# Altium schematic sheet UltraSoonSensor.SchDoc
size A4; SheetNumber: 6
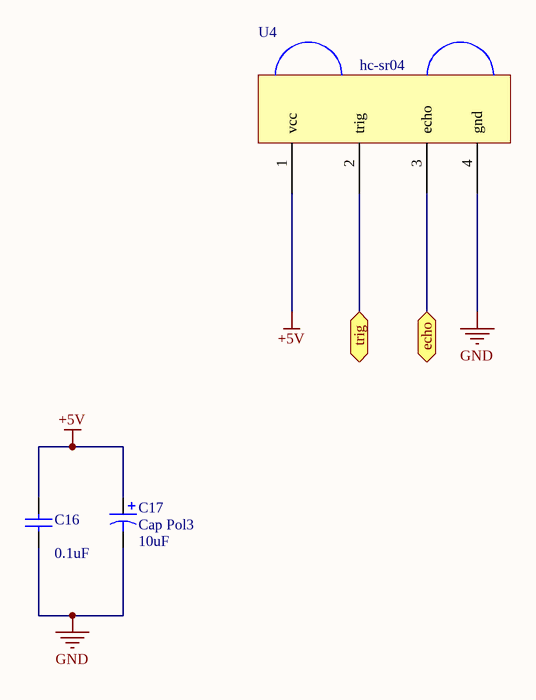
[diagram p0: UltraSoonSensor.SchDoc]

## Parts
C16  value 0.1uF  [C1206]  (hidden comment: Cap Semi)
C17  Cap Pol3  value 10uF  [C0805]
U4  hc-sr04  [ultrasoonSensor]

## Ports
echo, trig

## Nets
+5V: C16.1 C17.1 U4.1(vcc)
GND: C16.2 C17.2 U4.4(gnd)
echo: U4.3(echo) ; port echo
trig: U4.2(trig) ; port trig

## Library data of the parts
C16 = Cap Semi: Capacitor (Semiconductor SIM Model); Published: 8-Jun-2000; LatestRevisionDate: 29-May-2009; LatestRevisionNote: IPC-7351 Footprint Added.; PackageReference: C1206; Publisher: Altium Limited; PackageDescription: Chip Capacitor
C17 = Cap Pol3: Polarized Capacitor (Surface Mount); Published: 8-Jun-2000; LatestRevisionDate: 29-May-2009; LatestRevisionNote: IPC-7351 Footprint Added.; PackageReference: C0805; Publisher: Altium Limited; PackageDescription: Chip Capacitor
U4 = Component_1